# EAGLE design auto_dtm (EAGLE 6.5.0)
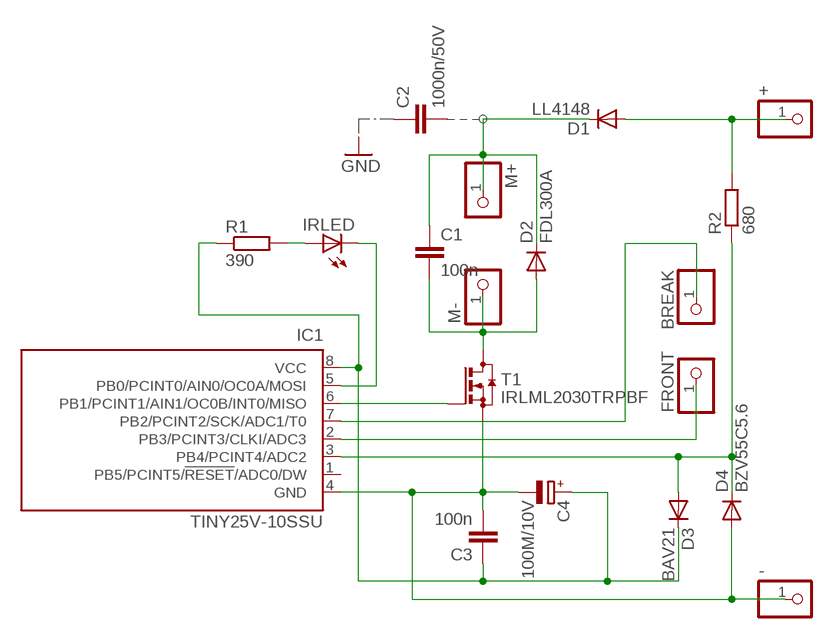
[diagram p0: schematic, sheet 1]

## Parts
+  PINHD-1X1  [1X01]
-  PINHD-1X1  [1X01]
BREAK  PINHD-1X1  [1X01]
C1  100n  C-EUC1206  [C1206]
C2  1000n/50V  C-EU025-024X044  [C025-024X044]
C3  100n  C-EUC1206  [C1206]
C4  100M/10V  CPOL-EUSMCC  [SMC_C]
D1  LL4148  DIODE-MINIMELF  [MINIMELF]
D2  FDL300A  DIODE-MINIMELF  [MINIMELF]
D3  BAV21  DIODE-MINIMELF  [MINIMELF]
D4  BZV55C5.6  DIODE-MINIMELF  [MINIMELF]
FRONT  PINHD-1X1  [1X01]
IC1  TINY25V-10SSU  TINY13-20SSU  [8S1]
IRLED  LED3MM  [LED3MM]
M+  PINHD-1X1  [1X01]
M-  PINHD-1X1  [1X01]
R1  390  R-EU_R1206  [R1206]
R2  680  R-EU_R1206  [R1206]
T1  IRLML2030TRPBF  BSS123  [SOT23]

## Nets
GND: -.1 C3.2 C4.- D4.A IC1.4(GND) T1.2(S)
N$1: IC1.6(PB1/PCINT1/AIN1/OC0B/INT0/MISO) T1.1(G)
N$2: C1.2 D2.A M-.1 T1.3(D)
N$3: C1.1 D1.C D2.C M+.1
N$5: IC1.5(PB0/PCINT0/AIN0/OC0A/MOSI) IRLED.K(C)
N$6: +.1 D1.A R2.2
N$7: IRLED.A R1.2
N$9: D3.A D4.C IC1.3(PB4/PCINT4/ADC2) R2.1
N$10: FRONT.1 IC1.2(PB3/PCINT3/CLKI/ADC3)
N$12: BREAK.1 IC1.7(PB2/PCINT2/SCK/ADC1/T0)
VCC: C3.1 C4.+ D3.C IC1.8(VCC) R1.1
Unconnected: C2.1 C2.2 IC1.1(PB5/PCINT5/!RESET!/ADC0/DW)

## Library data of the parts
+ - BREAK FRONT M+ M- = pinhead:PINHD-1X1: PIN HEADER
C1-C3 = rcl:C-EU: CAPACITOR, European symbol
C4 = rcl:CPOL-EU: POLARIZED CAPACITOR, European symbol
D1-D4 = diode:DIODE-: DIODE
IC1 = atmel:TINY13: 8-bit AVR Microcontroller with 1K Bytes In-System Programmable Flash Source: http://www.atmel.com/dyn/resources/prod_documents/2535S.pdf; MPN: ATTINY13-20SSU; OC_FARNELL: 1455133; OC_NEWARK: 58M3771
IRLED = led:LED: LED OSRAM: - CHIPLED LG R971, LG N971, LY N971, LG Q971, LY Q971, LO R971, LY R971 LH N974, LH R974 LS Q976, LO Q976, LY Q976 LO Q996 - Hyper CHIPLED LW Q18S LB Q993, LB Q99A, LB R99A - SideLED LS A670, LO A670, LY A670, LG A670, LP A670 LB A673, LV A673, LT A673, LW A673 LH A674 LY A675 LS A676, LA A676, LO A676, LY A676, LW A676 LS A679, LY A679, LG A679 - Hyper Micro SIDELED® LS Y876, LA Y876, LO Y876, LY Y876 LT Y87S - SmartLED LW L88C, LW L88S LB L89C, LB L89S, LG L890 LS L89K, LO L89K, LY L89K LS L896, LA L896, LO L896, LY L896 - TOPLED LS T670, LO T670, LY T670, LG T670, LP T670 LSG T670, LSP T670, LSY T670, LOP T670, LYG T670 LG T671, LOG T671, LSG T671 LB T673, LV T673, LT T673, LW T673 LH T674 LS T676, LA T676, LO T676, LY T676, LB T676, LH T676, LSB T676, LW T676 LB T67C, LV T67C, LT T67C, LS T67K, LO T67K, LY T67K, LW E67C LS E67B, LA E67B, LO E67B, LY E67B, LB E67C, LV E67C, LT E67C LW T67C LS T679, LY T679, LG T679 LS T770, LO T770, LY T770, LG T770, LP T770 LB T773, LV T773, LT T773, LW T773 LH T774 LS E675, LA E675, LY E675, LS T675 LS T776, LA T776, LO T776, LY T776, LB T776 LHGB T686 LT T68C, LB T68C - Hyper Mini TOPLED® LB M676 - Mini TOPLED Santana® LG M470 LS M47K, LO M47K, LY M47K Source: http://www.osram.convergy.de LUXEON: - LUMILED® LXK2-PW12-R00, LXK2-PW12-S00, LXK2-PW14-U00, LXK2-PW14-V00 LXK2-PM12-R00, LXK2-PM12-S00, LXK2-PM14-U00 LXK2-PE12-Q00, LXK2-PE12-R00, LXK2-PE12-S00, LXK2-PE14-T00, LXK2-PE14-U00 LXK2-PB12-K00, LXK2-PB12-L00, LXK2-PB12-M00, LXK2-PB14-N00, LXK2-PB14-P00, LXK2-PB14-Q00 LXK2-PR12-L00, LXK2-PR12-M00, LXK2-PR14-Q00, LXK2-PR14-R00 LXK2-PD12-Q00, LXK2-PD12-R00, LXK2-PD12-S00 LXK2-PH12-R00, LXK2-PH12-S00 LXK2-PL12-P00, LXK2-PL12-Q00, LXK2-PL12-R00 Source: www.luxeon.com KINGBRIGHT: KA-3528ASYC Source: www.kingbright.com
R1 R2 = rcl:R-EU_: RESISTOR, European symbol
T1 = transistor-small-signal:BSS123: N-CHANNEL MOS FET

## Board
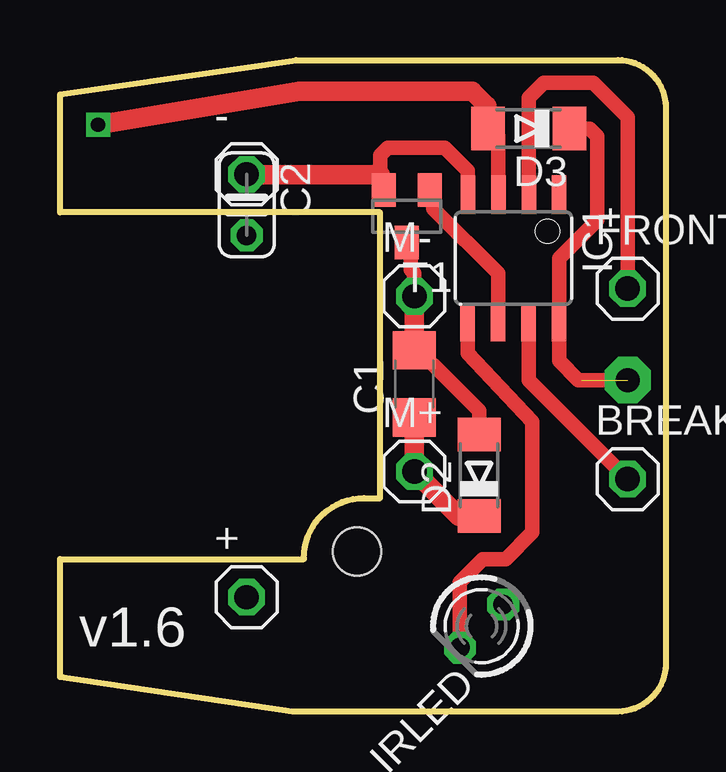
[diagram p1: board, top side]
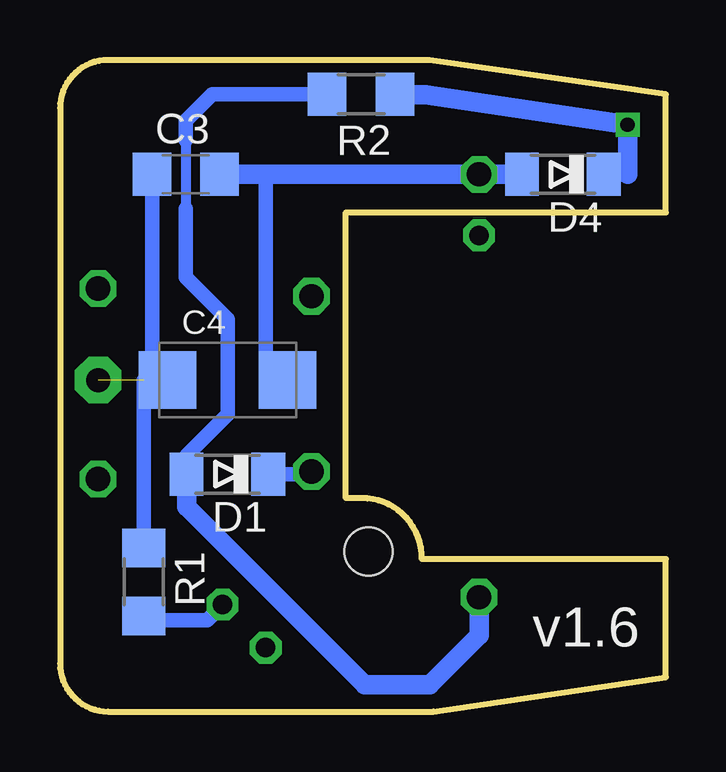
[diagram p2: board, bottom side, seen from below]

Size 25.24 x 27.15 mm. Coordinates in mm from the lower left corner, seen from the top.
Outline: 9.84,27.15 23.24,27.15 arc-90 25.24,25.15 25.24,2 arc-90 23.24,0 9.68,0 0,1.43 0,6.35 10.16,6.35 10.16,6.39 arc-90 12.66,8.89 13.34,8.89 13.34,20.8 0,20.8 0,25.72 9.84,27.15
Copper layers (1*16): Top 0.035mm / dielectric 1.5mm / Bottom 0.035mm
Design rules "default": minimum track width 10mil, minimum drill 24mil, track to track 8mil, track to pad 8mil, pad to pad 8mil, via to via 8mil, smd to smd 8mil, copper to edge 40mil, drill to drill 8mil, minimum pad ring 10mil, minimum via ring 8mil, stop-mask expansion 4mil, vias tented up to drill 0mil, thermal gap 10mil
Holes 2 mm at 12.38,6.67

### Footprints (pad centres in the part's own frame; a part is rotated, then mirrored left to right if it is on the bottom)
1X01 = drill 1.016 octagon: 1 0,0
C1206 = smd 1.6 x 1.8: 1 -1.4,0; 2 1.4,0
C025-024X044 = drill 0.813 octagon: 1 -1.27,0; 2 1.27,0
SMC_C = smd 2.4 x 2.4: + -2.5,0; - 2.5,0
MINIMELF = smd 1.4 x 1.8: A 1.7,0; C -1.7,0
8S1 = smd 0.6 x 1.6: 1 -1.905,-2.654; 2 -0.645,-2.654; 3 0.625,-2.654; 4 1.895,-2.654; 5 1.905,2.654; 6 0.635,2.654; 7 -0.635,2.654; 8 -1.905,2.654
LED3MM = drill 0.813 octagon: A -1.27,0; K 1.27,0
R1206 = smd 1.6 x 1.803: 1 -1.422,0; 2 1.422,0
SOT23 = smd 1 x 1.4: 1 -0.95,-1.1; 2 0.95,-1.1; 3 0,1.1

### Placement (x,y rotation side)
+  7.78,4.76 0 top
-  7.78,22.38 0 top
BREAK  23.65,9.68 0 top
C1  14.76,13.65 90 top
C2  7.78,21.11 270 top
C3  20,22.38 0 bottom
C4  18.26,13.81 0 bottom
D1  18.26,9.89 180 bottom
D2  17.46,9.84 90 top
D3  19.53,24.29 180 top
D4  4.29,22.38 180 bottom
FRONT  23.65,17.62 0 top
IC1  18.89,18.89 180 top
IRLED  17.57,3.56 225 top
M+  14.76,10 0 top
M-  14.76,17.3 0 top
R1  21.75,5.4 270 bottom
R2  12.7,25.72 180 bottom
T1  14.45,20.64 180 top

### Tracks (layer width: path | path; a pad name or v marks a point on that pad's centre or on a via)
GND
  Top 0.61: 13.18,22.53 T1.2 13.34,21.9 13.34,23.18 13.65,23.49 16.03,23.49 17,22.53 IC1.4
  Top 0.813: -.1 13.34,22.37 T1.2
  Bottom 0.61: 16.19,13.65 16.19,13.97 16.67,14.45 16.67,22.23 16.51,22.38
  Bottom 0.813: D4.A -.1 16.51,22.38 C3.2 | 16.19,13.65 15.91,13.65 | 15.91,13.65 C4.- | 15.91,13.65 15.91,13.97
N$1
  Top 0.61: T1.1 15.56,22.05 15.56,20.96 18.26,18.26 IC1.6
N$2
  Top 0.61: D2.A 17.46,12.54 15.56,14.45 14.89,14.92 C1.2 | T1.3 14.61,19.53 14.61,18.42 14.76,18.26 M-.1
  Top 0.813: M-.1 C1.2
N$3
  Top 0.813: C1.1 M+.1 16.62,8.14 D2.C
  Bottom 0.61: D1.C 14.88,9.89 M+.1
N$5
  Top 0.406: IRLED.K 16.66,2.5
  Top 0.61: IC1.5 16.99,14.92 19.68,12.07 19.68,7.46 18.57,6.35 17.62,6.35 16.66,5.39 16.66,2.5
N$6
  Bottom 0.406: 20,23.81 20,20.96
  Bottom 0.61: R2.2 18.89,25.72 20,24.61 20,23.81 | 20,20.96 20,18.1 18.26,16.35 18.26,12.38 19.96,10.67 D1.A
  Bottom 0.813: +.1 7.78,3.18 9.84,1.11 12.54,1.11 19.96,8.53 D1.A
N$7
  Bottom 0.61: R1.2 21.58,3.81 19.11,3.81 IRLED.A
N$9  (via drill 0.6)
  Top 0.61: IC1.3 18.27,23.85 D3.A
  Top 0.813: 18.15,23.96 D3.A 17.78,24.33 17.78,25.24 17.17,25.85 9.97,25.85 v1.59,24.45
  Bottom 0.61: D4.C 1.59,22.38
  Bottom 0.813: R2.1 11.15,25.69 10,25.69 v1.59,24.45 1.59,22.38
N$10
  Top 0.61: IC1.2 19.54,25.57 20.16,26.19 22.22,26.19 23.65,24.76 FRONT.1
N$12
  Top 0.61: IC1.7 19.53,13.81 BREAK.1
VCC  (via drill 1 pad 1.93)  (1 unrouted)
  Top 0.61: v23.65,13.81 21.59,13.81 20.8,14.6 IC1.8 20.8,18.89 22.38,20.48 22.38,23.97 22.07,24.29 D3.C
  Bottom 0.61: R1.1 21.75,13.49 | C4.+ 21.27,13.81 | 21.27,13.81 21.43,13.81 21.75,13.49 | 21.75,13.49 21.75,13.81 | C3.1 21.4,13.94 21.27,13.81
  Bottom 0.813: 21.27,22.35 C3.1 | R1.1 21.75,6.67 21.91,6.83

### Text on the board
tPlace: v1.6
bPlace: v1.6